# EAGLE design V2-2layer (EAGLE 9.6.2)
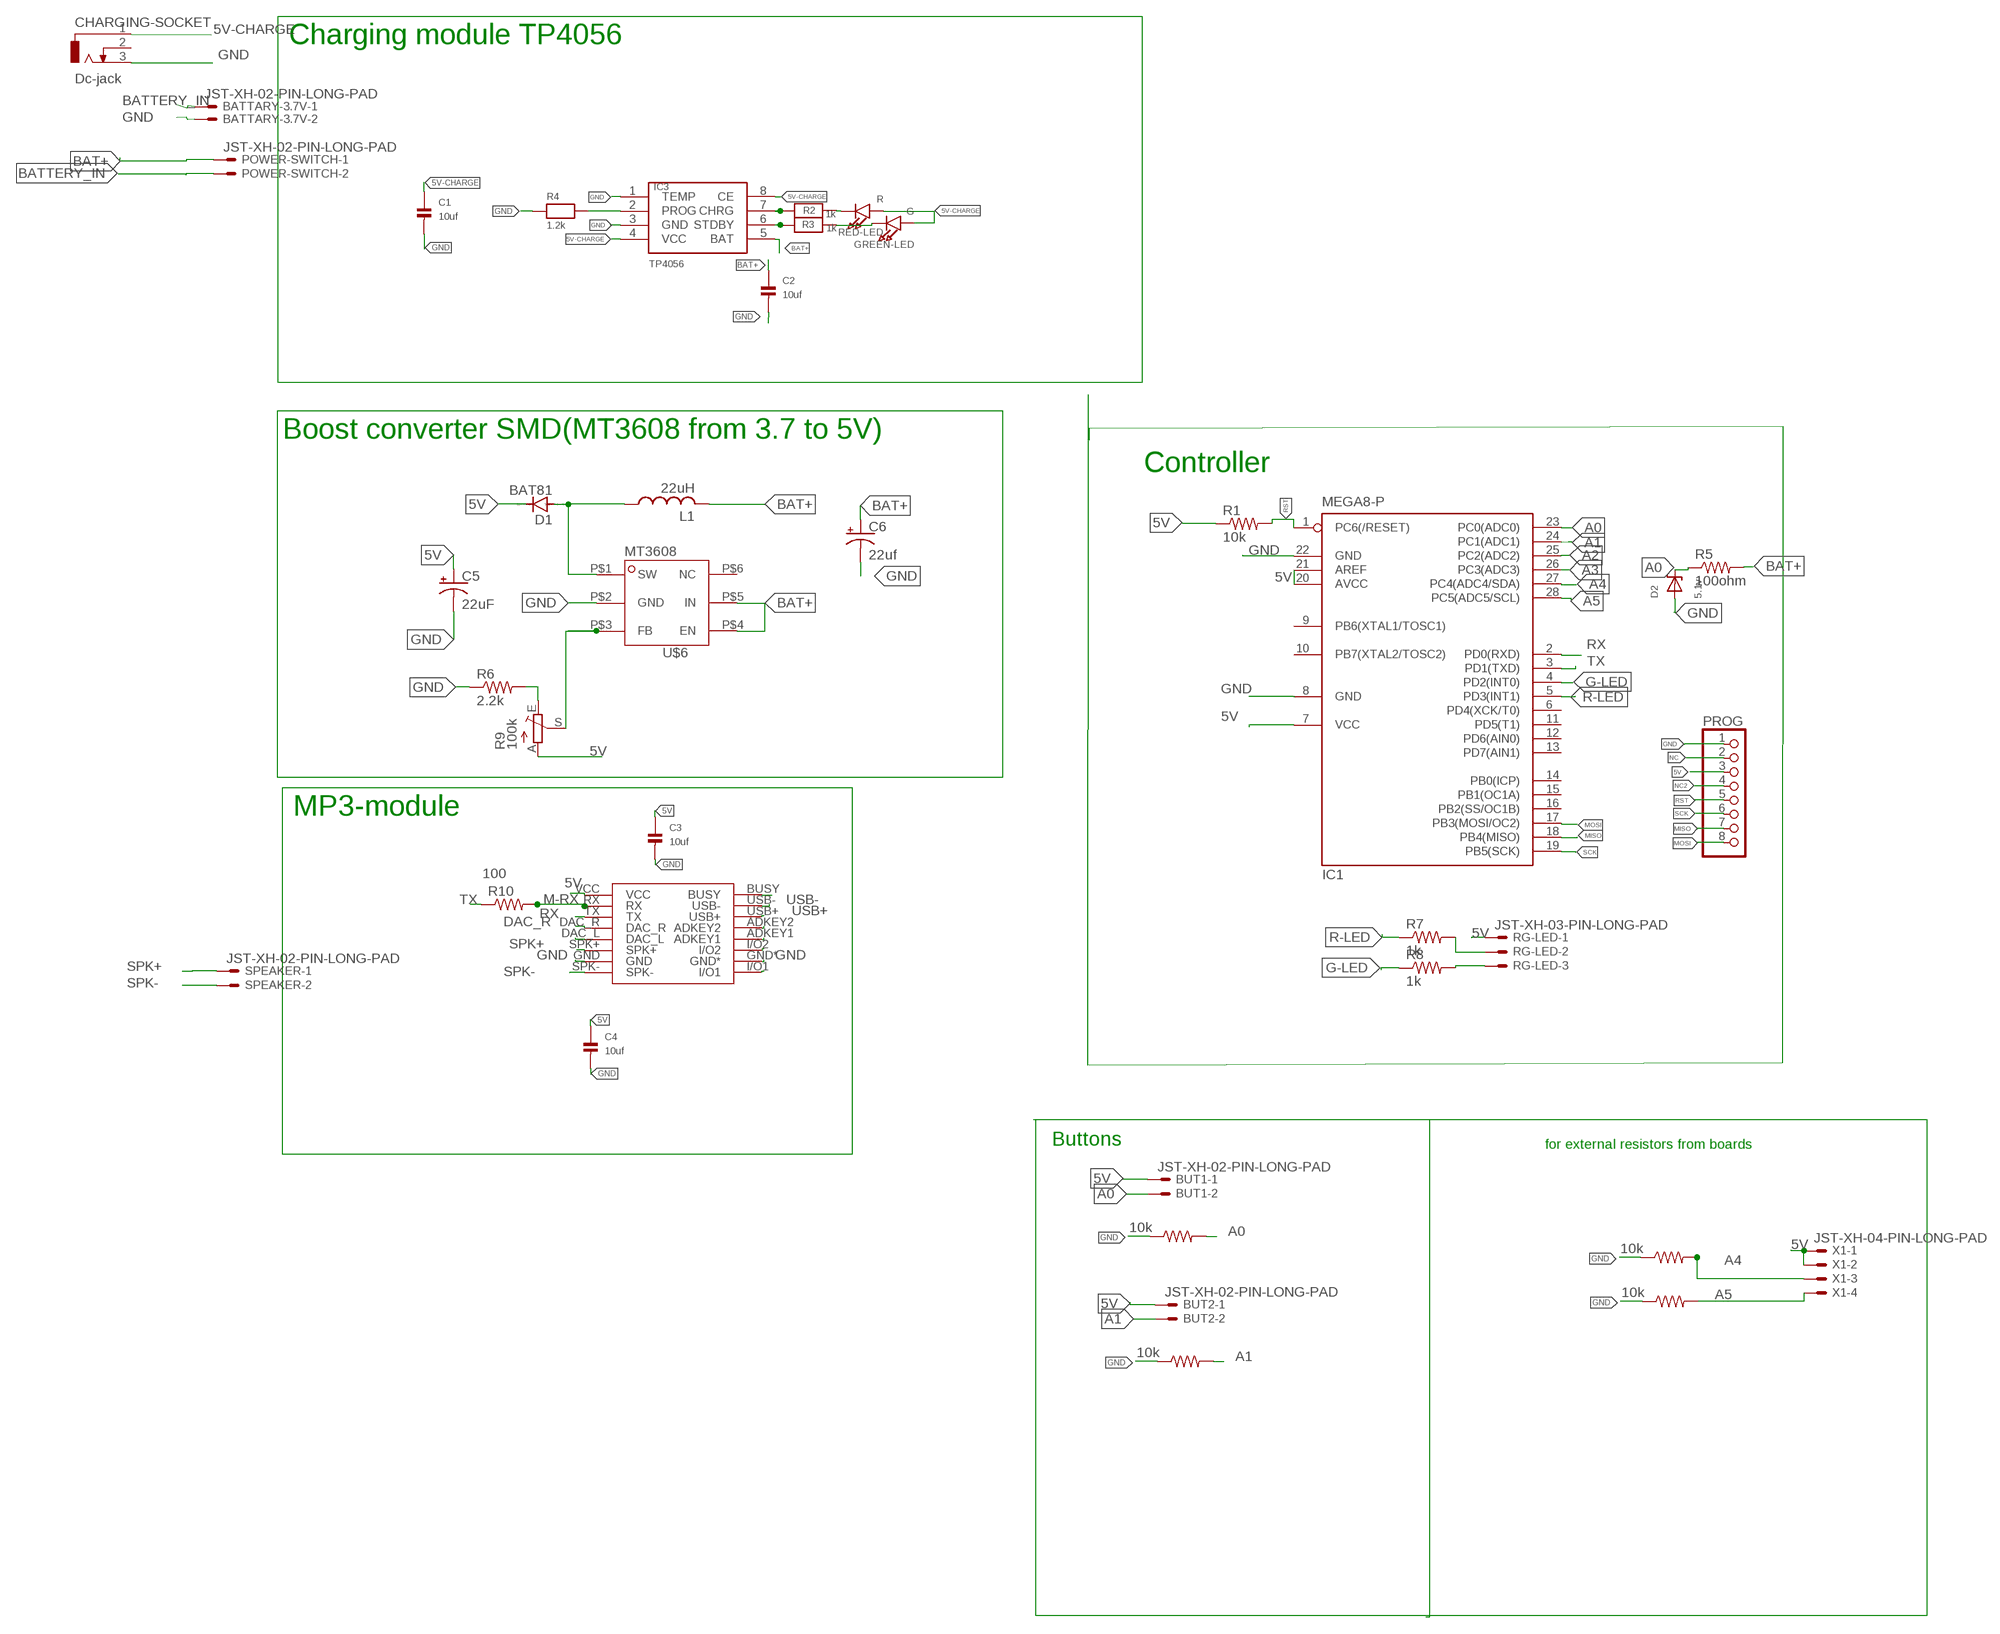
[diagram p0: schematic, sheet 1]

## Parts
BATTARY-3.7V  JST-XH-02-PIN-LONG-PAD  [JST-XH-02-PACKAGE-LONG-PAD]
BUT1  JST-XH-02-PIN-LONG-PAD  [JST-XH-02-PACKAGE-LONG-PAD]
BUT2  JST-XH-02-PIN-LONG-PAD  [JST-XH-02-PACKAGE-LONG-PAD]
C1  10uf  CAP_CERAMIC0805  [0805]
C2  10uf  CAP_CERAMIC0805  [0805]
C3  10uf  CAP_CERAMIC0805  [0805]
C4  10uf  CAP_CERAMIC0805  [0805]
C5  22uF  CPOL-USE2,5-6E  [E2,5-6E]
C6  22uf  CPOL-USE2,5-6E  [E2,5-6E]
CHARGING-SOCKET  Dc-jack  CON_JACK  [DCJ0303]
D1  BAT81  [DO34-7]
D2  5.1v  DIODE-ZENER  [SMADIODE]
GREEN-LED  G  LED0805  [CHIPLED_0805]
IC1  MEGA8-P  [DIL28-3]
IC3  TP4056  [SOP-8]
KEYPADS  10k  RES-7  [0204/7]
KEYPADS1  10k  RES-7  [0204/7]
KEYPADS2  10k  RES-7  [0204/7]
KEYPADS3  10k  RES-7  [0204/7]
L1  22uH  L-USL1812  [L1812]
POWER-SWITCH  JST-XH-02-PIN-LONG-PAD  [JST-XH-02-PACKAGE-LONG-PAD]
PROG  PINHD-1X8  [1X08]
R1  10k  R-US_0204/7  [0204/7]
R2  1k  RESISTOR_0805  [_0805]
R3  1k  RESISTOR_0805  [_0805]
R4  1.2k  RESISTOR_0805  [_0805]
R5  100ohm  R-US_0204/7  [0204/7]
R6  2.2k  R-US_M0805  [M0805]
R7  1k  R-US_0204/7  [0204/7]
R8  1k  R-US_0204/7  [0204/7]
R9  100k  TRIM_EU-B25U  [B25U]
R10  100  RES-7  [0204/7]
RED-LED  R  LED0805  [CHIPLED_0805]
RG-LED  JST-XH-03-PIN-LONG-PAD  [JST-XH-03-PACKAGE-LONG-PAD]
SPEAKER  JST-XH-02-PIN-LONG-PAD  [JST-XH-02-PACKAGE-LONG-PAD]
U$2  MP3_MODULE  [MP3_MODULE]
U$6  MT3608SOT23-6  [SOT23-6]
X1  JST-XH-04-PIN-LONG-PAD  [JST-XH-04-PACKAGE-LONG-PAD]

## Nets
5V: BUT1.1 BUT2.1 C3.1 C4.1 C5.+ D1.C IC1.7(VCC) IC1.20(AVCC) IC1.21(AREF) PROG.3 R1.1 R9.A RG-LED.1 U$2.VCC X1.1 X1.2
5V-CHARGE: C1.1 CHARGING-SOCKET.1 GREEN-LED.A IC3.4(VCC) IC3.8(CE) RED-LED.A
A0: BUT1.2 D2.C IC1.23(PC0(ADC0)) KEYPADS.2 R5.1
A1: BUT2.2 IC1.24(PC1(ADC1)) KEYPADS3.2
A2: IC1.25(PC2(ADC2))
A3: IC1.26(PC3(ADC3))
A4: IC1.27(PC4(ADC4/SDA)) KEYPADS1.2 X1.3
A5: IC1.28(PC5(ADC5/SCL)) KEYPADS2.2 X1.4
BAT+: C2.1 C6.+ IC3.5(BAT) L1.2 POWER-SWITCH.1 R5.2 U$6.P$4(EN) U$6.P$5(IN)
BATTERY_IN: BATTARY-3.7V.1 POWER-SWITCH.2
DAC_L: U$2.DAC_L
DAC_R: U$2.DAC_R
G-LED: IC1.4(PD2(INT0)) R8.1
GND: BATTARY-3.7V.2 C1.2 C2.2 C3.2 C4.2 C5.- C6.- CHARGING-SOCKET.3 D2.A IC1.8(GND) IC1.22(GND) IC3.1(TEMP) IC3.3(GND) KEYPADS1.1 KEYPADS2.1 KEYPADS3.1 KEYPADS.1 PROG.1 R4.1 R6.1 U$2.GND U$2.GND* U$6.P$2(GND)
M-RX: R10.2 U$2.RX
MISO: IC1.18(PB4(MISO)) PROG.7
MOSI: IC1.17(PB3(MOSI/OC2)) PROG.8
N$5: IC3.2(PROG) R4.2
N$7: R7.2 RG-LED.2
N$8: U$2.BUSY
N$11: U$2.ADKEY2
N$12: U$2.ADKEY1
N$13: U$2.I/O2
N$15: U$2.I/O1
N$16: R8.2 RG-LED.3
N$17: IC3.7(CHRG) R2.1
N$18: IC3.6(STDBY) R3.1
N$20: GREEN-LED.C R3.2
N$21: R6.2 R9.E
N$22: R2.2 RED-LED.C
N$24: R9.S U$6.P$3(FB)
N$30: D1.A L1.1 U$6.P$1(SW)
NC: PROG.2
NC2: PROG.4
R-LED: IC1.5(PD3(INT1)) R7.1
RST: IC1.1(PC6(/RESET)) PROG.5 R1.2
RX: IC1.2(PD0(RXD)) U$2.TX
SCK: IC1.19(PB5(SCK)) PROG.6
SPK+: SPEAKER.1 U$2.SPK+
SPK-: SPEAKER.2 U$2.SPK-
TX: IC1.3(PD1(TXD)) R10.1
USB+: U$2.USB+
USB-: U$2.USB-
Unconnected: CHARGING-SOCKET.2 IC1.6(PD4(XCK/T0)) IC1.9(PB6(XTAL1/TOSC1)) IC1.10(PB7(XTAL2/TOSC2)) IC1.11(PD5(T1)) IC1.12(PD6(AIN0)) IC1.13(PD7(AIN1)) IC1.14(PB0(ICP)) IC1.15(PB1(OC1A)) IC1.16(PB2(SS/OC1B)) U$6.P$6(NC)

## Notes on the sheet
- Charging module TP4056
- Boost converter SMD(MT3608 from 3.7 to 5V)
- Controller
- MP3-module
- Buttons | for external resistors from boards

## Library data of the parts
BATTARY-3.7V BUT1 BUT2 POWER-SWITCH SPEAKER = connector-data - JST XH Connectors v1-0:JST-XH-02-PIN: JST XH Connector 2 Pin Wire to board connector. Pitch: 2,54 mm, (0.100") Number of pins: 2 Created by Rembrandt Electronics www.rembrandtelectronics.com
C1-C4 = microbuilder:CAP_CERAMIC: Ceramic Capacitors 0402 - 0402 Surface Mount Capacitors 16pF 50V 5% [Digikey: 445-4899-2-ND] 18pF 50V 5% [Digikey: 490-1281-2-ND] 22pF 50V 5% [Digikey: 490-1283-2-ND] 68pF 50V 5% [Digikey: 490-1289-2-ND] 0.1uF 10V 10% [Digikey: 490-1318-2-ND] 1.0uF 6.3V 10% [Digikey: 490-1320-2-ND] 0603 - 0603 Surface Mount Capacitors 16 pF 50V 5% [Digikey: 445-5051-2-ND] 22 pF 50V [Digikey: PCC220ACVTR-ND] 33 pF 50V 5% [Digikey: 490-1415-1-ND] 56pF 50V 5% [Digikey: 490-1421-1-ND] 220pF 50V 5% [Digikey: 445-1285-1-ND] 680 pF 50V 2200 pF 50V 5% C0G [Digikey: 445-1297-1-ND] 5600 pF 100V 5% X7R [Digikey: 478-3711-1-ND] 0.1 µF 25V 10% [Digikey: PCC2277TR-ND] 0.22 µF 16V 10% X7R [Digikey: 445-1318-1-ND] 1.0 µF 25V 10% [Digikey: 445-5146-2-ND] 0603 - RF Specific 3pF 250V +/-0.1pF RF [Digikey: 712-1347-1-ND] 18 pF 250V 5% [Digikey: 478-3505-1-ND or 712-1322-1-ND] 56 pF 250V 5% C0G RF [Digikey: 490-4867-1-ND] 68 pF 250V RF [Digikey: 490-4868-1-ND] 0805 - 0805 Surface Mount Capacitors 220 pF 250V 2% RF Ceramic Capacitor [Digikey: 712-1398-1-ND] 1000 pF 50V 2% NP0 Ceramic Capacitor [Digikey: 478-3760-1-ND] 0.1 µF 25V 10% Ceramic Capacitor [Digikey: PCC1828TR-ND] 1.0 µF 16V 10% Ceramic Capacitor[Digikey: 490-1691-2-ND] 10.0 µF 10V 10% Ceramic Capacitor[Digikey: 709-1228-1-ND] 10.0 uF 16V 10% Ceramic Capacitor [Digikey: 478-5165-2-ND] 47 uF 6.3V 20% Ceramic Capacitor [Digikey: 587-1779-1-ND or 399-5506-1-ND] 1206 - 1206 Surface Mount Capacitors 47uF 10V 20% Ceramic Capacitor [Digikey: 490-5528-1-ND or 399-5508-1-ND or 445-6010-1-ND] 100uF 6.3V -20%, +80% Y5V Ceramic Capacitor (Digikey: 490-4512-1-ND, Mouser: 81-GRM31CF50J107ZE1L)
C5 C6 = rcl:CPOL-US: POLARIZED CAPACITOR, American symbol; SPICEPREFIX: C
CHARGING-SOCKET = MIA_LIBRARY-2-2:CON_JACK: DC POWER JACK Source: DCJ0303.pdf; OC_FARNELL: unknown; OC_NEWARK: unknown
D1 = diode:BAT81: DIODE barrier diode
D2 = microbuilder:DIODE-ZENER: Zener Diode SMA: 30V 1W Zener Diode, 1.2Vf - Digikey: SMAZ30-FDICT-ND
GREEN-LED RED-LED = microbuilder:LED: LED 0603 - 0603 Surface Mount Package 2mA: Green LED - Low Power (3.9mcd, 2ma, 1.7Vf) - Digikey: 475-2709-2-ND Orange LED - Low Power (9.8mcd, 2ma, 1.8Vf) - Digikey: 475-1194-2-ND Red LED - Low Power (5mcd, 2ma, 1.8Vf) - Digikey: 475-1195-2-ND Yellow LED - Low Power (7mcd, 2ma, 1.8Vf) - Digikey: 475-1196-2-ND 5mA: Blue LED - Low Power (17mcd, 5ma, 2.9Vf) - Digikey: LNJ937W8CRACT-ND 0805 - 0805 Surface Mount Package 2mA: Red LED (8.8mcd, 2mA, 1.8Vf, Clear) - Low Power [Digikey: 475-2510-1-ND] Green LED (5mcd, 2mA, 1.8Vf, Clear) - Low Power [Digikey: 475-2730-1-ND] Yellow LED (11.3mcd, 2mA, 1.8Vf, Clear) - Low Power [Digikey: 475-2555-1-ND] 20mA: Red LED (104mcd, 20mA, Diffused) - LS R976 [Digikey: 475-1278-6-ND] Red LED (12mcd, 20mA, 2.0Vf, Clear) - APT2012EC [Digikey: 754-1128-1-ND] Green LED (15mcd, 20mA, 2.2Vf, Clear) - APT2012GC [Digikey: 754-1131-1-ND] Orange LED (160mcd, 20mA, 2.1Vf, Clear) - APT2012SECK [Digikey: 754-1130-1-ND] 1206 - 1206 Surface Mount Package Green LED (26mcd, 20mA, Diffused) - LG N971 [Digikey: 475-1407-6-ND] Red LED (15mcd, 20mA, Diffused) - LH N974 [Digikey: 475-1416-6-ND]
IC1 = atmel:MEGA8-P: MICROCONTROLLER 8 Kbytes FLASH, 1 kbytes SRAM, 512 bytes EEPROM, USART, 4-channel 10 bit ADC, 2-channel 8 bit ADC Pin compatible with Atmega48, ATMega88, ATMega168 Source: avr.lbr; OC_FARNELL: unknown; OC_NEWARK: unknown
IC3 = TP4056:TP4056
KEYPADS KEYPADS1-KEYPADS3 R10 = MIA_LIBRARY-2-2:RES-7
L1 = rcl:L-US: INDUCTOR, American symbol; SPICEPREFIX: L
PROG = pinhead:PINHD-1X8: PIN HEADER
R1 R5-R8 = rcl:R-US_: RESISTOR, American symbol; SPICEPREFIX: R
R2-R4 = microbuilder:RESISTOR: Resistors 0402 - 0402 Surface Mount Package 22 Ohm 1% 1/16W [Digikey: 311-22.0LRTR-ND] 33 Ohm 5% 1/16W 1.0K 5% 1/16W 1.5K 5% 1/16W 2.0K 1% 1/16W 10.0K 1% 1/16W [Digikey: 311-10.0KLRTR-ND] 10.0K 5% 1/16W [Digikey: RMCF0402JT10K0TR-ND] 12.1K 1% 1/16W [Digikey: 311-22.0LRTR-ND] 100.0K 5% 1/16W 0603 - 0603 Surface Mount Package 0 Ohm 1/10 Watt 1% Resistor 15 Ohm 1/10 Watt 1% Resistor 33 Ohm 1/10 Watt 1% Resistor 49.9 Ohm 1/10 Watt 1% Resistor 100 Ohm 1/10 Watt 1% Resistor 150 Ohm 1/10 Watt 1% Resistor 240 Ohm 1/10 Watt 1% Resistor 390 Ohm 1/10 Watt 1% Resistor 560 Ohm 1/10 Watt 1% Resistor 680 Ohm 1/10 Watt 1% Resistor 750 Ohm 1/10 Watt 1% Resistor 1.0K Ohm 1/10 Watt 1% Resistor 1.5K Ohm 1/10 Watt 1% Resistor 2.0K Ohm 1/10 Watt 1% Resistor 2.2K Ohm 1/10 Watt 1% Resistor 3.3K Ohm 1/10 Watt 1% Resistor 4.7K Ohm 1/10 Watt 1% Resistor 10.0K Ohm 1/10 Watt 1% Resistor 12.0K Ohm 1/10 Watt 1% Resistor 12.1K Ohm 1/10 Watt 1% Resistor 20.0K Ohm 1/10 Watt 1% Resistor 33.0K Ohm 1/10 Watt 1% Resistor 100.0K Ohm 1/10 Watt 1% Resistor 0805 - 0805 Surface Mount Package 0 Ohm 1/8 Watt 1% Resistor 33 Ohm 1/8 Watt 1% Resistor 100 Ohm 1/8 Watt 1% Resistor 150 Ohm 1/8 Watt 1% Resistor 200 Ohm 1/8 Watt 1% Resistor 240 Ohm 1/8 Watt 1% Resistor 330 Ohm 1/8 Watt 1% Resistor 390 Ohm 1/8 Watt 1% Resistor 470 Ohm 1/8 Watt 1% Resistor 1.0K Ohm 1/8 Watt 1% Resistor 1.5K Ohm 1/8 Watt 1% Resistor 2.0K Ohm 1/8 Watt 1% Resistor 4.7K Ohm 1/8 Watt 1% Resistor 5.1K Ohm 1/8 Watt 1% Resistor 5.6K Ohm 1/8 Watt 1% Resistor 10.0K Ohm 1/8 Watt 1% Resistor 22.0K Ohm 1/8 Watt 1% Resistor 33.0K Ohm 1/8 Watt 1% Resistor 100K Ohm 1/8 Watt 1% Resistor 1206 - 1206 Surface Mount Package 2012 - 2010 Surface Mount Package 0.11 Ohm 1/2 Watt 1% Resistor - Digikey: RHM.11UCT-ND
R9 = pot:TRIM_EU-: POTENTIOMETER
RG-LED = connector-data - JST XH Connectors v1-0:JST-XH-03-PIN: JST XH Connector 2 Pin Wire to board connector. Pitch: 2,54 mm, (0.100") Number of pins: 3 Created by Rembrandt Electronics www.rembrandtelectronics.com
U$2 = MIA_LIBRARY-2-2:MP3_MODULE
U$6 = MT3608:MT3608: MT3608 High Efficiency 1.2MHz 2A Step Up Converter BY: Rangana Tennakoon
X1 = connector-data - JST XH Connectors v1-0:JST-XH-04-PIN: JST XH Connector 2 Pin Wire to board connector. Pitch: 2,54 mm, (0.100") Number of pins: 4 Created by Rembrandt Electronics www.rembrandtelectronics.com

## Board
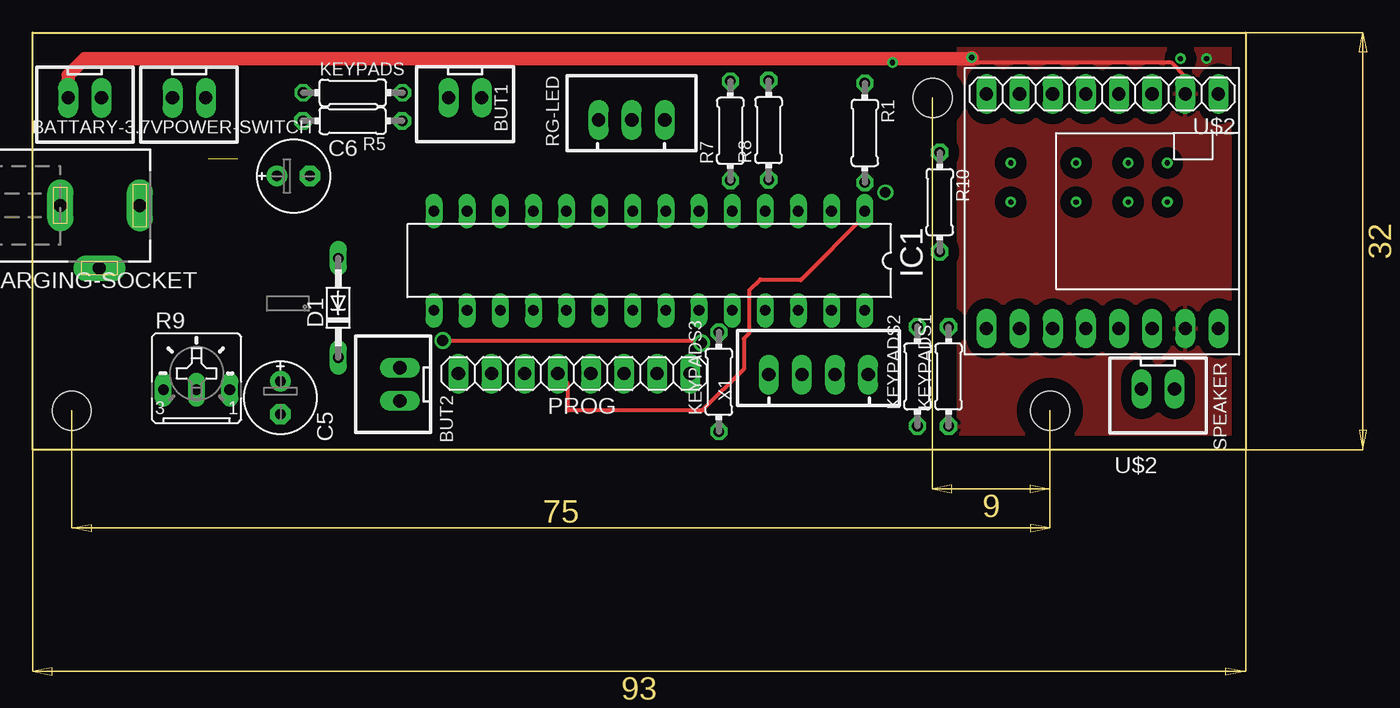
[diagram p1: board, top side]
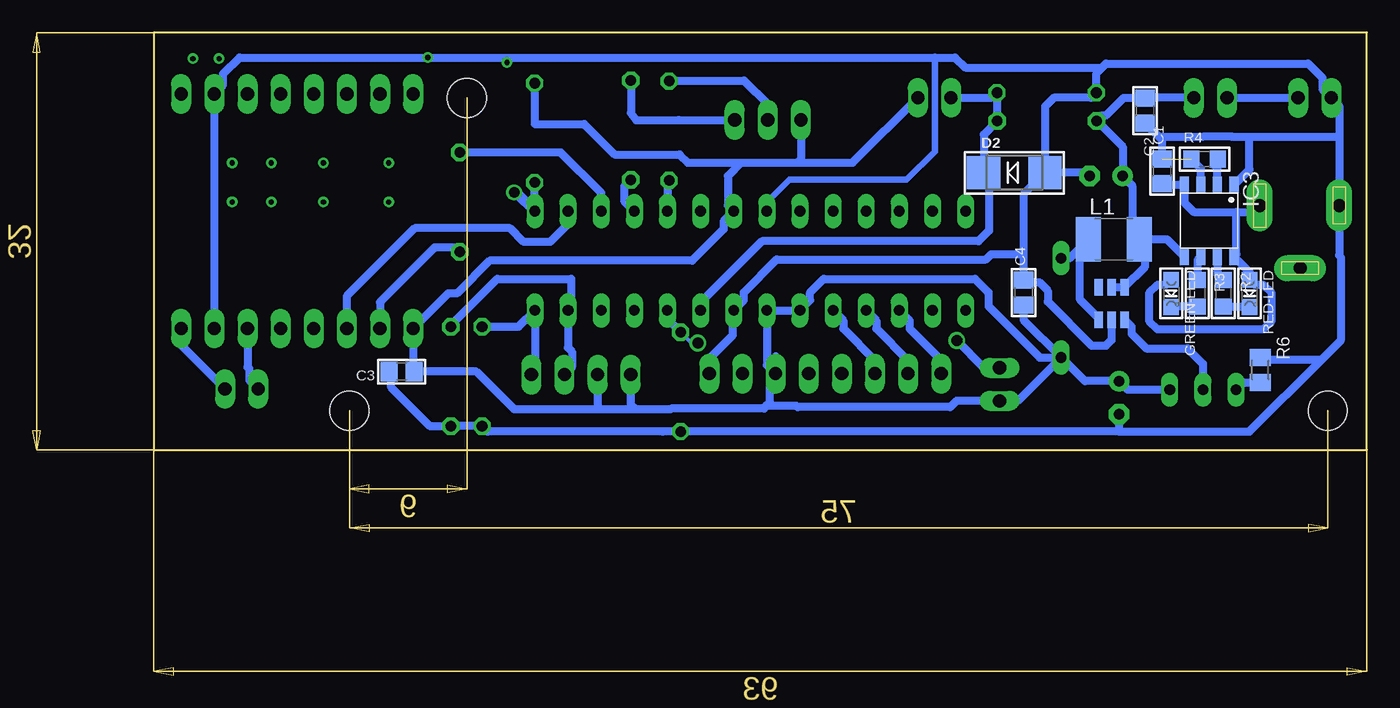
[diagram p2: board, bottom side, seen from below]

Size 93 x 32 mm. Coordinates in mm from the lower left corner, seen from the top.
Outline: 0,32 93,32 93,0 0,0 0,32
Copper layers (1*16): Top 0.035mm / dielectric 1.5mm / Bottom 0.035mm
Design rules "default *": minimum track width 6mil, minimum drill 0.35mm, track to track 0.8mm, track to pad 0.8mm, pad to pad 0.02031875mm, via to via 0.8mm, smd to smd 6mil, copper to edge 40mil, drill to drill 6mil, minimum pad ring 10mil, minimum via ring 8mil, stop-mask expansion 4mil, vias tented up to drill 0mil, thermal gap 10mil
Holes 3 mm at 3,3 78,3 69,27

### Footprints (pad centres in the part's own frame; a part is rotated, then mirrored left to right if it is on the bottom)
JST-XH-02-PACKAGE-LONG-PAD = drill 1.016 long: 1 -1.27,0; 2 1.27,0
0805 = smd 1.3 x 1.5: 1 -0.95,0; 2 0.95,0
E2,5-6E = drill 0.813 pad 1.575: + -1.27,0 | drill 0.813 pad 1.575 octagon: - 1.27,0
DCJ0303 = drill 1 pad 2 long: 1 0,3.1; 2 4.8,0; 3 0,-3
DO34-7 = drill 0.813 long: A 3.81,0; C -3.81,0
SMADIODE = smd 2.54 x 2.54: A 2.349,0; C -2.349,0
CHIPLED_0805 = smd 1.2 x 1.2: A 0,-1.05; C 0,1.05
DIL28-3 = drill 0.813 long: 1 -16.51,-3.81; 2 -13.97,-3.81; 3 -11.43,-3.81; 4 -8.89,-3.81; 5 -6.35,-3.81; 6 -3.81,-3.81; 7 -1.27,-3.81; 8 1.27,-3.81; 9 3.81,-3.81; 10 6.35,-3.81; 11 8.89,-3.81; 12 11.43,-3.81; 13 13.97,-3.81; 14 16.51,-3.81; 15 16.51,3.81; 16 13.97,3.81; 17 11.43,3.81; 18 8.89,3.81; 19 6.35,3.81; 20 3.81,3.81; 21 1.27,3.81; 22 -1.27,3.81; 23 -3.81,3.81; 24 -6.35,3.81; 25 -8.89,3.81; 26 -11.43,3.81; 27 -13.97,3.81; 28 -16.51,3.81
SOP-8 = smd 1.3 x 0.7: 1 -2.75,1.905; 2 -2.75,0.635; 3 -2.75,-0.635; 4 -2.75,-1.905; 5 2.75,-1.905; 6 2.75,-0.635; 7 2.75,0.635; 8 2.75,1.905
0204/7 = drill 0.813 octagon: 1 -3.81,0; 2 3.81,0
L1812 = smd 1.9 x 3.4: 1 -1.95,0; 2 1.95,0
1X08 = drill 1.016 long: 1 -8.89,0; 2 -6.35,0; 3 -3.81,0; 4 -1.27,0; 5 1.27,0; 6 3.81,0; 7 6.35,0; 8 8.89,0
_0805 = smd 1.2 x 1.3: 1 -1.016,0; 2 1.016,0
M0805 = smd 1.3 x 1.6: 1 -0.95,0; 2 0.95,0
B25U = drill 0.813 long: A 2.54,-0.889; E -2.54,-0.889; S 0,-0.889
JST-XH-03-PACKAGE-LONG-PAD = drill 1.016 long: 1 -2.54,0; 2 0,0; 3 2.54,0
MP3_MODULE = drill 1.016 long: ADKEY1 10,-0.81; ADKEY2 10,1.73; BUSY 10,9.35; DAC_L -8,-0.81; DAC_R -8,1.73; GND -8,-5.89; GND* 10,-5.89; I/O1 10,-8.43; I/O2 10,-3.35; RX -8,6.81; SPK+ -8,-8.43; SPK- -8,-3.35; TX -8,4.27; USB+ 10,4.27; USB- 10,6.81; VCC -8,9.35
SOT23-6 = smd 1.27 x 0.635: P$1 0,0; P$2 0,-1; P$3 0,-2; P$4 2.5,-2; P$5 2.5,-1; P$6 2.5,0
JST-XH-04-PACKAGE-LONG-PAD = drill 1.016 long: 1 -3.81,0; 2 -1.27,0; 3 1.27,0; 4 3.81,0

### Placement (x,y rotation side)
BATTARY-3.7V  4,27 180 top
BUT1  33.16,27.01 180 top
BUT2  28.16,5.02 90 top
C1  15.71,21.36 90 bottom
C2  17.01,26.02 270 bottom
C3  74,6 180 bottom
C4  26.32,12.06 90 bottom
C5  19,4 270 top
C6  20,21 0 top
CHARGING-SOCKET  5.12,18.74 270 top
D1  23.43,10.89 90 top
D2  27.03,21.25 0 bottom
GREEN-LED  15,12 180 bottom
IC1  47.28,14.5 180 top
IC3  12.09,17.57 270 bottom
KEYPADS  24.55,27.39 0 top
KEYPADS1  70.23,5.62 90 top
KEYPADS2  67.84,5.63 90 top
KEYPADS3  52.62,5.21 90 top
L1  19.4,16.14 0 bottom
POWER-SWITCH  12,27 180 top
PROG  41.53,5.85 180 top
R1  63.81,24.31 270 top
R2  11,12 270 bottom
R3  13,12 270 bottom
R4  12.45,22.29 0 bottom
R5  24.53,25.23 180 top
R6  8.18,6.13 270 bottom
R7  53.5,24.47 90 top
R8  56.43,24.52 90 top
R9  12.57,5.49 0 top
R10  69.55,19 270 top
RED-LED  9,12 180 bottom
RG-LED  45.93,25.3 0 top
SPEAKER  86.28,4.67 180 top
U$2  82.48,17.3 90 top
U$6  20.58,9.98 90 bottom
X1  60.25,5.77 0 top

### Tracks (layer width: path | path; a pad name or v marks a point on that pad's centre or on a via)
5V
  Bottom 0.6: 45.34,7.18 PROG.3 45.75,6.27 45.75,6.25 | 45.75,6.25 46.01,6.5 IC1.21 IC1.20 42.69,11.47 42.69,12.08 41.66,13.11 30.04,13.11 29.01,12.08 29.01,11.01 25.08,7.08 D1.C | BUT1.1 39.43,22.01 43.68,22.01 | 47.99,22.01 43.68,22.01 | 47.99,22.01 49,21 49,18.76 IC1.7 49.33,17.53 49.33,16.92 51.74,14.51 67.26,14.51 69.77,12 70.43,12 U$2.VCC 73.13,6.08 C3.1 68.27,6 65.37,3.1 58.98,3.1 | RG-LED.1 43.39,22.3 43.68,22.01 | R1.1 63.81,24.99 60.02,24.99 57.67,22.64 52.69,22.64 52.06,22.01 47.99,22.01 | C4.1 26.32,9.97 D1.C | 46.04,3.42 46,3.38 | R9.A 18.2,4.6 18.22,4.62 18.35,4.62 C5.+ 21.62,5.27 D1.C | D1.C 26.76,3.75 BUT2.1 31.46,3.75 31.94,3.28 43.64,3.28 43.74,3.38 46,3.38 | 46,3.38 45.75,3.62 45.75,6.25 | 56,3.1 53.41,3.1 53.35,3.16 46.22,3.16 46,3.38 | 56,3.1 58.98,3.1 | X1.1 56.44,3.54 56,3.1 | X1.2 58.98,3.1
5V-CHARGE
  Bottom 0.6: C1.1 15.62,20.32 IC3.4 14,18.96 13.29,18.25 10,18.25 | 10,18.25 8.71,18.25 CHARGING-SOCKET.1 | 10,18.25 10,15 IC3.8 9,13.64 RED-LED.A 8.6,12.65 7.94,12.65 7.3,12.01 7.3,9.89 7.94,9.25 16.06,9.25 16.7,9.89 16.7,12.01 16.06,12.65 15.4,12.65 GREEN-LED.A
A0
  Bottom 0.6: BUT1.2 28.74,27.01 KEYPADS.2 28.36,25.25 R5.1 29.38,24.19 D2.C 28.97,20.84 28.97,16.81 29.78,16 46.37,16 51.09,11.28 IC1.23
A1  (via drill 0.85)
  Top 0.3: v51.3,8.19 51.3,8.28 51.2,8.37 v31.45,8.37 v31.45,8.38
  Bottom 0.3: v51.3,8.19 51.79,8.19 KEYPADS3.2
  Bottom 0.6: KEYPADS3.2 53.63,10.03 IC1.24 | BUT2.2 29.36,6.29 v31.45,8.38
A4
  Bottom 0.6: KEYPADS1.2 70.23,9.56 66.68,13.11 61,13.11 61,10.94 IC1.27 61.25,7.84 60.95,7.53 60.95,6.34 X1.3
A5
  Bottom 0.6: KEYPADS2.2 65.04,9.44 IC1.28 63.79,6.04 X1.4
BAT+
  Bottom 0.6: L1.2 18,16.69 18,20.27 C6.+ 18.73,23.24 R5.2 20.32,25.63 20.01,25.63 18.67,26.97 C2.1 16.98,27 POWER-SWITCH.1 | IC3.5 15.31,16.14 L1.2 | L1.2 17.14,16.14 17,16 17,14.06 U$6.P$4 U$6.P$5
BATTERY_IN
  Bottom 0.6: POWER-SWITCH.2 BATTARY-3.7V.1
G-LED
  Bottom 0.6: R8.1 56.95,20.19 56.95,19.09 IC1.4
GND  (via drill 0.4)  (1 unrouted)
  Top 0.3: U$2.GND* 88.37,28.63 87.29,29.71 v65.93,29.71
  Top 1.016: BATTARY-3.7V.2 2.73,28.73 4,30 72,30 v72,30.09
  Bottom 0.5: 33.12,30.09 33.12,22.88 35.29,20.71 44.29,20.71 46.01,18.99 IC1.8
  Bottom 0.6: 3.46,6.93 2.02,8.37 2.02,14.81 2.12,14.91 CHARGING-SOCKET.3 2.12,24 | 19,1.39 9,1.39 3.46,6.93 | 19,1.39 54,1.39 | 54,1.39 67.41,1.39 KEYPADS2.1 KEYPADS1.1 71.82,1.81 74.8,4.79 74.8,5.85 C3.2 | D2.A 24.68,26.32 24,27 21.13,27 KEYPADS.1 20.74,28.88 20.31,29.31 | C2.2 15.97,24.03 | 15.97,24.03 15.71,23.77 C1.2 | C6.- 21.52,21.25 D2.A | 2.12,24 2.12,26.39 BATTARY-3.7V.2 3.41,27.68 3.41,28.53 4.5,29.62 20,29.62 20.31,29.31 | 9,24 10.34,24 10.38,24.04 12.49,24.04 12.5,24.03 15.97,24.03 | 9,24 2.12,24 | PROG.1 50.42,6.99 48.63,8.78 48.63,10.61 IC1.22 47.77,11.47 47.77,12.08 45.25,14.6 29.2,14.6 28.8,15 26.32,15 | C5.- 19,1.39 | U$2.GND U$2.GND* 87.69,27.98 87.69,28.83 86.44,30.09 v72,30.09 33.12,30.09 31.57,30.09 30.8,29.31 20.31,29.31 | D2.A 26.32,19.61 26.32,15 | 26.32,15 C4.2 26.17,12.86 25.11,12.86 24.47,12.22 24.47,11.36 21.11,8 20,8 19.58,8.42 19.58,9 | IC3.3 12.73,21.55 R4.1 | IC3.1 9,21.51 9,24 | R6.1 8.03,6.93 3.46,6.93 | U$6.P$2 19.58,9 | 19.58,9 19.57,8.99 | KEYPADS3.1 53.99,1.4 54,1.39
  other vias: 90,30
  pour Top: 93,32 71,32 71,0 93,0
GND1  (via drill 0.4)
  other vias: 88,30
GND2  (via drill 0.4)
  other vias: 75,22
GND3  (via drill 0.4)
  other vias: 75,19
GND4  (via drill 0.4)
  other vias: 80,22
GND5  (via drill 0.4)
  other vias: 80,19
GND6  (via drill 0.4)
  other vias: 84,22
GND7  (via drill 0.4)
  other vias: 84,19
GND9  (via drill 0.4)
  other vias: 87,19
GND10  (via drill 0.4)
  other vias: 87,22
M-RX
  Bottom 0.6: R10.2 69.9,15.54 71.46,15.54 75.67,11.33 U$2.RX
MISO
  Bottom 0.6: 35.34,5.85 PROG.7 35.18,6.87 37.61,9.3 37.61,9.91 IC1.18
MOSI
  Bottom 0.6: 32.8,5.85 PROG.8 32.64,6.87 35.07,9.3 35.07,9.91 IC1.17
N$5
  Bottom 0.6: R4.2 11.45,22.27 11.45,21.61 | 11.45,21.61 11.73,21.88 | IC3.2 11.45,21.61
N$7
  Bottom 0.6: RG-LED.2 45.93,26.5 47.75,28.32 53.46,28.32 R7.2
N$16
  Bottom 0.6: R8.2 56.43,25.82 56.02,25.27 52.78,25.27 52.75,25.3 RG-LED.3
N$17
  Bottom 0.6: IC3.7 11.45,13.47 R2.1
N$18
  Bottom 0.6: IC3.6 13,14.55 R3.1
N$20
  Bottom 0.6: R3.2 14.97,10.98 GREEN-LED.C
N$21
  Bottom 0.6: R9.E 9.45,5.18 R6.2
N$22
  Bottom 0.6: R2.2 9.03,10.98 RED-LED.C
N$24
  Bottom 0.6: U$6.P$3 18.05,9.45 18.05,8.92 16.91,7.78 13.75,7.78 12.57,6.6 R9.S
N$30
  Bottom 0.6: D1.A 22.79,14.7 L1.1 22,15.49 22,11.51 20.58,10.09 U$6.P$1
R-LED
  Bottom 0.6: R7.1 53.63,20.59 IC1.5
RST  (via drill 0.8)
  Top 0.3: IC1.1 63.79,17.91 58.94,13.06 | 58.94,13.06 58.88,13 | PROG.5 41,5.11 41,3 51.34,3 54.53,6.19 54.53,8.53 54.93,8.93 54.93,12.2 55.79,13.06 58.94,13.06
  Bottom 0.6: IC1.1 63.81,18.33 R1.2
  Bottom 0.8: PROG.5 40.26,4.99 | IC1.1 65.22,19.74 v65.38,19.74
RX
  Bottom 0.6: IC1.2 61.25,17.31 62.61,15.95 64.65,15.95 65.7,17 73,17 78.21,11.79 U$2.TX
SCK
  Bottom 0.6: 37.88,5.85 PROG.6 37.72,6.87 40.15,9.3 40.15,9.91 IC1.19
SPK+
  Bottom 0.6: U$2.SPK+ 90.91,8.03 SPEAKER.1
SPK-
  Bottom 0.6: U$2.SPK- 85.83,6.34 85.69,6.2 85.69,5.35 SPEAKER.2
TX
  Bottom 0.6: IC1.3 58.71,19.71 61.81,22.81 R10.1